# EAGLE schematic LTC4418_Schematic (EAGLE 9.1.3)
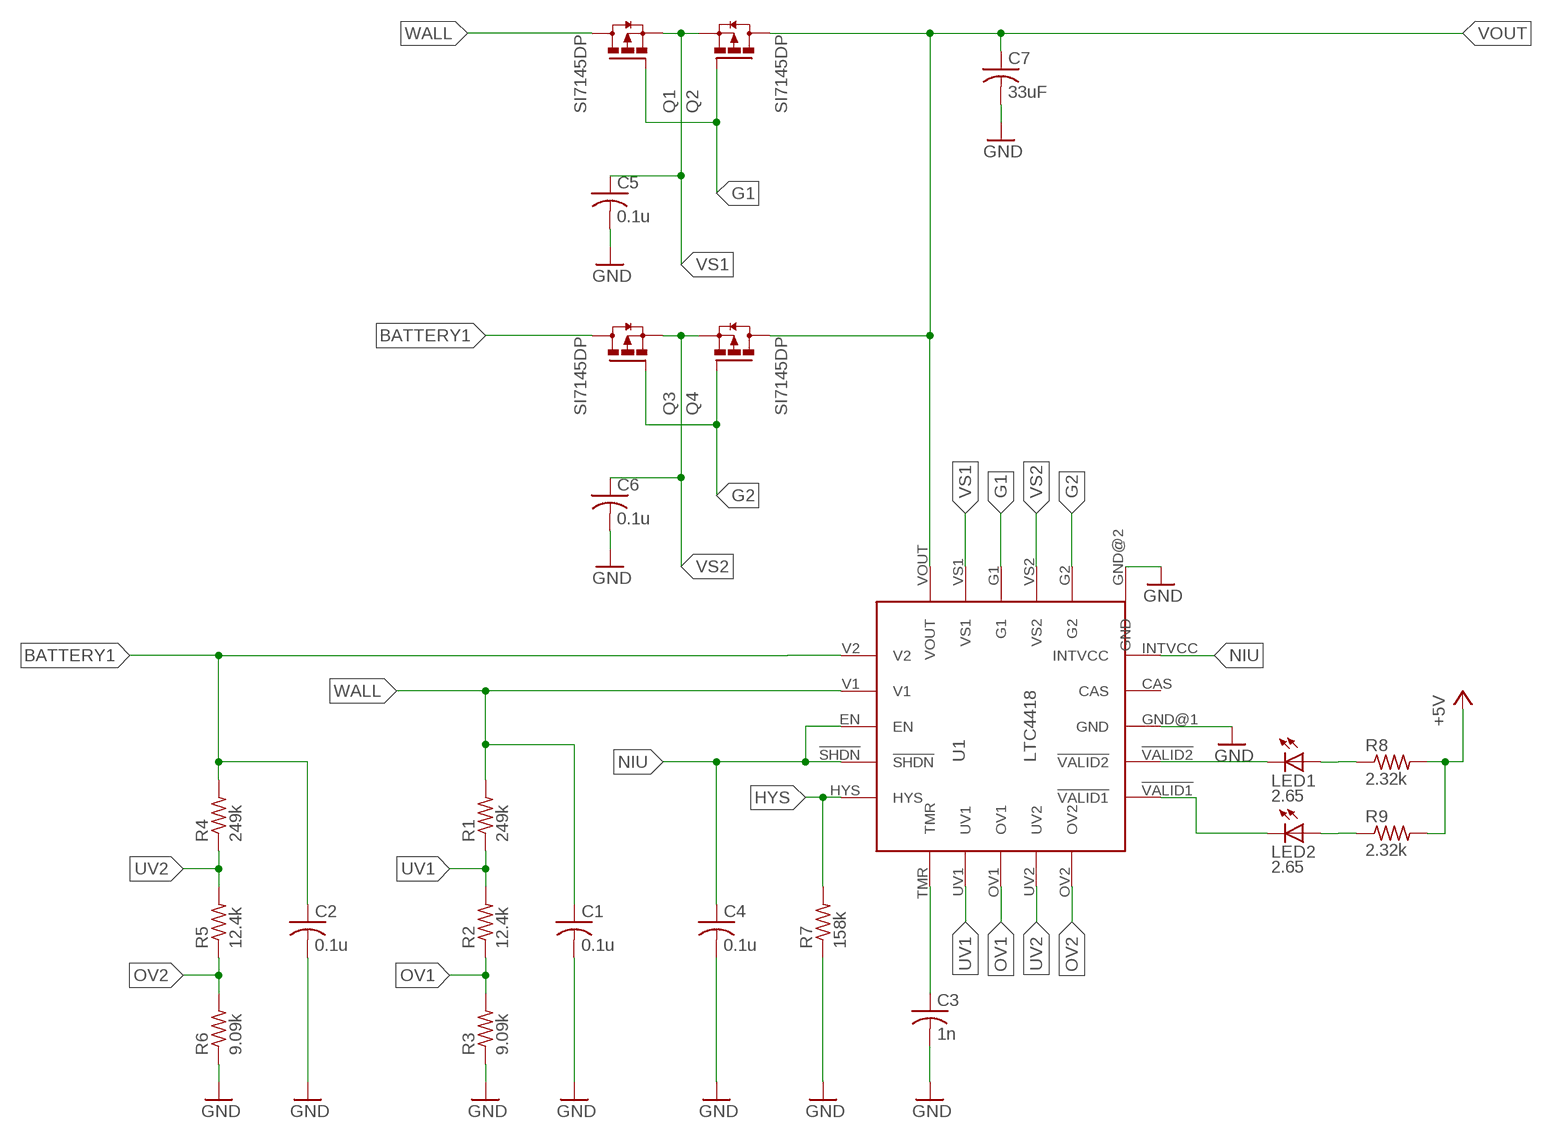
[diagram p0: schematic, sheet 1]

## Parts
C1  0.1u  C-USC1206  [C1206]
C2  0.1u  C-USC1206  [C1206]
C3  1n  C-USC1206  [C1206]
C4  0.1u  C-USC1206  [C1206]
C5  0.1u  C-USC1206  [C1206]
C6  0.1u  C-USC1206  [C1206]
C7  33uF  C-USC1206  [C1206]
LED1  2.65  LEDSML0805  [SML0805]
LED2  2.65  LEDSML0805  [SML0805]
Q1  SI7145DP  [SO-8/PPAK/TEST]
Q2  SI7145DP  [SO-8/PPAK/TEST]
Q3  SI7145DP  [SO-8/PPAK/TEST]
Q4  SI7145DP  [SO-8/PPAK/TEST]
R1  249k  R-US_R1206  [R1206]
R2  12.4k  R-US_R1206  [R1206]
R3  9.09k  R-US_R1206  [R1206]
R4  249k  R-US_R1206  [R1206]
R5  12.4k  R-US_R1206  [R1206]
R6  9.09k  R-US_R1206  [R1206]
R7  158k  R-US_R1206  [R1206]
R8  2.32k  R-US_R1206  [R1206]
R9  2.32k  R-US_R1206  [R1206]
U1  LTC4418  [20-QFN(4X4)]

## Nets
!VALID1: LED2.C U1.!VALID1
+5V: R8.2 R9.2
BATTERY1: C2.1 Q3.D@1(D) Q3.D@2(D) Q3.D@3(D) Q3.D@4(D) Q3.D@5(D) R4.2 U1.V2
G1: Q1.G Q2.G U1.G1
G2: Q3.G Q4.G U1.G2
GND: C1.2 C2.2 C3.2 C4.2 C5.2 C6.2 C7.2 R3.1 R6.1 R7.1 U1.GND@1(GND) U1.GND@2(GND)
HYS: R7.2 U1.HYS
N$1: C3.1 U1.TMR
N$2: LED1.A R8.1
N$3: LED2.A R9.1
N$4: LED1.C U1.!VALID2
NIU: C4.1 U1.!SHDN U1.EN U1.INTVCC
OV1: R2.1 R3.2 U1.OV1
OV2: R5.1 R6.2 U1.OV2
UV1: R1.1 R2.2 U1.UV1
UV2: R4.1 R5.2 U1.UV2
VOUT: C7.1 Q2.D@1(D) Q2.D@2(D) Q2.D@3(D) Q2.D@4(D) Q2.D@5(D) Q4.D@1(D) Q4.D@2(D) Q4.D@3(D) Q4.D@4(D) Q4.D@5(D) U1.VOUT
VS1: C5.1 Q1.S@1(S) Q1.S@2(S) Q1.S@3(S) Q2.S@1(S) Q2.S@2(S) Q2.S@3(S) U1.VS1
VS2: C6.1 Q3.S@1(S) Q3.S@2(S) Q3.S@3(S) Q4.S@1(S) Q4.S@2(S) Q4.S@3(S) U1.VS2
WALL: C1.1 Q1.D@1(D) Q1.D@2(D) Q1.D@3(D) Q1.D@4(D) Q1.D@5(D) R1.2 U1.V1
Unconnected: U1.CAS

## Library data of the parts
C1-C7 = adafruit:C-US: CAPACITOR, American symbol
LED1 LED2 = led:LED: LED OSRAM: - CHIPLED LG R971, LG N971, LY N971, LG Q971, LY Q971, LO R971, LY R971 LH N974, LH R974 LS Q976, LO Q976, LY Q976 LO Q996 - Hyper CHIPLED LW Q18S LB Q993, LB Q99A, LB R99A - SideLED LS A670, LO A670, LY A670, LG A670, LP A670 LB A673, LV A673, LT A673, LW A673 LH A674 LY A675 LS A676, LA A676, LO A676, LY A676, LW A676 LS A679, LY A679, LG A679 - Hyper Micro SIDELED® LS Y876, LA Y876, LO Y876, LY Y876 LT Y87S - SmartLED LW L88C, LW L88S LB L89C, LB L89S, LG L890 LS L89K, LO L89K, LY L89K LS L896, LA L896, LO L896, LY L896 - TOPLED LS T670, LO T670, LY T670, LG T670, LP T670 LSG T670, LSP T670, LSY T670, LOP T670, LYG T670 LG T671, LOG T671, LSG T671 LB T673, LV T673, LT T673, LW T673 LH T674 LS T676, LA T676, LO T676, LY T676, LB T676, LH T676, LSB T676, LW T676 LB T67C, LV T67C, LT T67C, LS T67K, LO T67K, LY T67K, LW E67C LS E67B, LA E67B, LO E67B, LY E67B, LB E67C, LV E67C, LT E67C LW T67C LS T679, LY T679, LG T679 LS T770, LO T770, LY T770, LG T770, LP T770 LB T773, LV T773, LT T773, LW T773 LH T774 LS E675, LA E675, LY E675, LS T675 LS T776, LA T776, LO T776, LY T776, LB T776 LHGB T686 LT T68C, LB T68C - Hyper Mini TOPLED® LB M676 - Mini TOPLED Santana® LG M470 LS M47K, LO M47K, LY M47K Source: http://www.osram.convergy.de LUXEON: - LUMILED® LXK2-PW12-R00, LXK2-PW12-S00, LXK2-PW14-U00, LXK2-PW14-V00 LXK2-PM12-R00, LXK2-PM12-S00, LXK2-PM14-U00 LXK2-PE12-Q00, LXK2-PE12-R00, LXK2-PE12-S00, LXK2-PE14-T00, LXK2-PE14-U00 LXK2-PB12-K00, LXK2-PB12-L00, LXK2-PB12-M00, LXK2-PB14-N00, LXK2-PB14-P00, LXK2-PB14-Q00 LXK2-PR12-L00, LXK2-PR12-M00, LXK2-PR14-Q00, LXK2-PR14-R00 LXK2-PD12-Q00, LXK2-PD12-R00, LXK2-PD12-S00 LXK2-PH12-R00, LXK2-PH12-S00 LXK2-PL12-P00, LXK2-PL12-Q00, LXK2-PL12-R00 Source: www.luxeon.com KINGBRIGHT: KA-3528ASYC Source: www.kingbright.com
Q1-Q4 = Moira:SI7145DP: MOSFET P-CH 30V 60A PPAK SO-8 Digikey: SI7145DP-T1-GE3CT-ND
R1-R9 = adafruit:R-US_: RESISTOR, American symbol
U1 = Moira:LTC4418: OR Controller Source Selector Switch P-Channel 2:1 20-QFN (4x4) Digikey: LTC4418IUF#PBF-ND